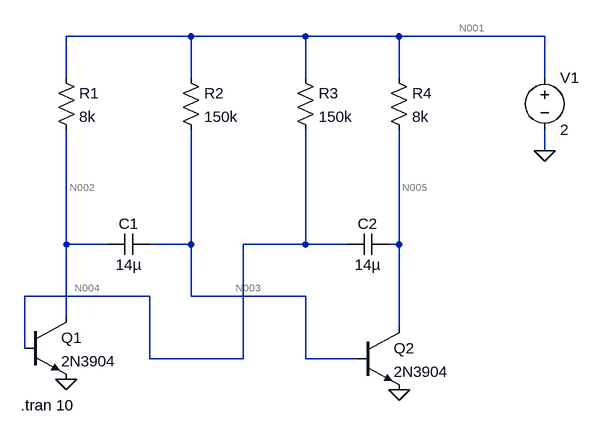
[diagram p0: schematic Draft2.asc]
Draft2.asc, the LTspice schematic file:
Version 4
SHEET 1 880 680
WIRE 240 16 48 16
WIRE 416 16 240 16
WIRE 560 16 416 16
WIRE 784 16 560 16
WIRE 48 80 48 16
WIRE 240 80 240 16
WIRE 416 80 416 16
WIRE 560 80 560 16
WIRE 784 80 784 16
WIRE 784 192 784 160
WIRE 48 336 48 160
WIRE 112 336 48 336
WIRE 240 336 240 160
WIRE 240 336 176 336
WIRE 416 336 416 160
WIRE 416 336 320 336
WIRE 480 336 416 336
WIRE 560 336 560 160
WIRE 560 336 544 336
WIRE 176 416 -16 416
WIRE 240 416 240 336
WIRE 416 416 240 416
WIRE 48 448 48 336
WIRE 560 464 560 336
WIRE -16 496 -16 416
WIRE 176 512 176 416
WIRE 320 512 320 336
WIRE 320 512 176 512
WIRE 416 512 416 416
WIRE 496 512 416 512
FLAG 48 544 0
FLAG 560 560 0
FLAG 784 192 0
SYMBOL res 32 64 R0
SYMATTR InstName R1
SYMATTR Value 8k
SYMBOL res 224 64 R0
SYMATTR InstName R2
SYMATTR Value 150k
SYMBOL res 400 64 R0
SYMATTR InstName R3
SYMATTR Value 150k
SYMBOL res 544 64 R0
SYMATTR InstName R4
SYMATTR Value 8k
SYMBOL cap 176 320 R90
WINDOW 0 0 32 VBottom 2
WINDOW 3 32 32 VTop 2
SYMATTR InstName C1
SYMATTR Value 14µ
SYMBOL cap 544 320 R90
WINDOW 0 0 32 VBottom 2
WINDOW 3 32 32 VTop 2
SYMATTR InstName C2
SYMATTR Value 14µ
SYMBOL npn -16 448 R0
SYMATTR InstName Q1
SYMATTR Value 2N3904
SYMBOL npn 496 464 R0
SYMATTR InstName Q2
SYMATTR Value 2N3904
SYMBOL voltage 784 64 R0
WINDOW 123 0 0 Left 0
WINDOW 39 0 0 Left 0
SYMATTR InstName V1
SYMATTR Value 2
TEXT -22 584 Left 2 !.tran 10

The netlist it stands for:
* Draft2.asc
R1 N001 N002 8k
R2 N001 N003 150k
R3 N001 N004 150k
R4 N001 N005 8k
C1 N003 N002 14µ
C2 N005 N004 14µ
Q1 N002 N004 0 0 2N3904
Q2 N005 N003 0 0 2N3904
V1 N001 0 2
.model NPN NPN
.model PNP PNP
.lib standard.bjt
.tran 10
.backanno
.end

* Results of the author's LTspice run, read from the files saved beside the schematic
* Operating Point, zero values left out:
*   V(n001) = 2 V
*   V(n002) = 55.95 mV
*   V(n003) = 622.9 mV
*   V(n004) = 622.9 mV
*   V(n005) = 55.95 mV
*   Ic(Q2) = 243 µA
*   Ib(Q2) = 9.18 µA
*   Ie(Q2) = -252.2 µA
*   Ic(Q1) = 243 µA
*   Ib(Q1) = 9.18 µA
*   Ie(Q1) = -252.2 µA
*   I(R4) = 243 µA
*   I(R3) = 9.18 µA
*   I(R2) = 9.18 µA
*   I(R1) = 243 µA
*   I(V1) = -504.4 µA
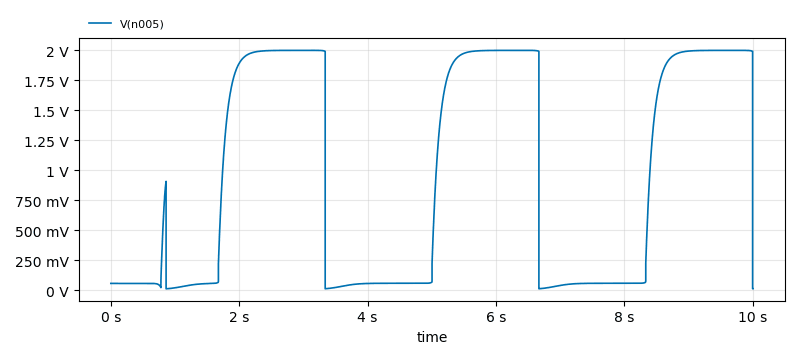
[diagram p1: Transient Analysis of Draft2.asc, plotted from the saved traces]
* Transient Analysis, 1 run:
*   V(n005): min 11.08 mV, max 2 V, average 965.3 mV, rms 1.345 V, last 11.64 mV